# EAGLE design GPS (EAGLE 7.3.0)
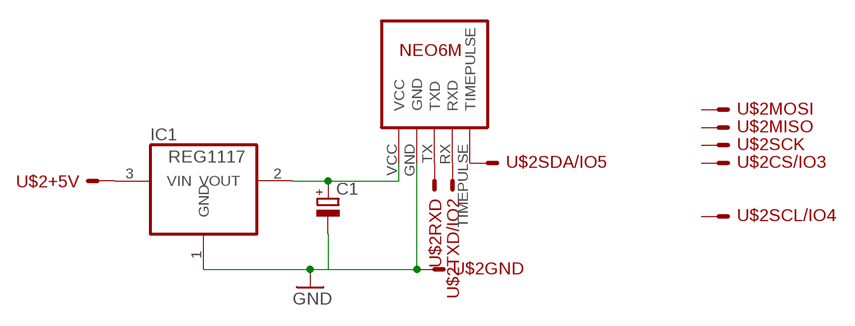
[diagram p0: schematic, sheet 1]

## Parts
C1  CPOL-EUB45181A  [B45181A]
IC1  REG1117  [SOT223]
U$1  NEO6M  [NEO6M]
U$2  LIMERO_BUS  [SPI_BUS]

## Nets
GND: C1.- IC1.1(GND) U$1.GND U$2.GND
N$1: C1.+ IC1.2(VOUT) U$1.VCC
N$3: U$1.TX(TXD) U$2.RXD
N$4: U$1.RX(RXD) U$2.TXD
N$5: U$1.TIMEPULSE U$2.SDA
N$6: IC1.3(VIN) U$2.+5V
Unconnected: U$2.CS U$2.MISO U$2.MOSI U$2.SCK U$2.SCL

## Library data of the parts
C1 = rcl:CPOL-EU: POLARIZED CAPACITOR, European symbol
IC1 = burr-brown:REG1117: 800mA and 1A Low Dropout (LDO) Positive Regulator 1.8V, 2.5V, 2.85V, 3.3V, 5V, and Adj; MPN: REG1117; OC_FARNELL: 1097566; OC_NEWARK: 14P6981
U$1 = lieven:NEO6M
U$2 = lieven:LIMERO_BUS

## Board
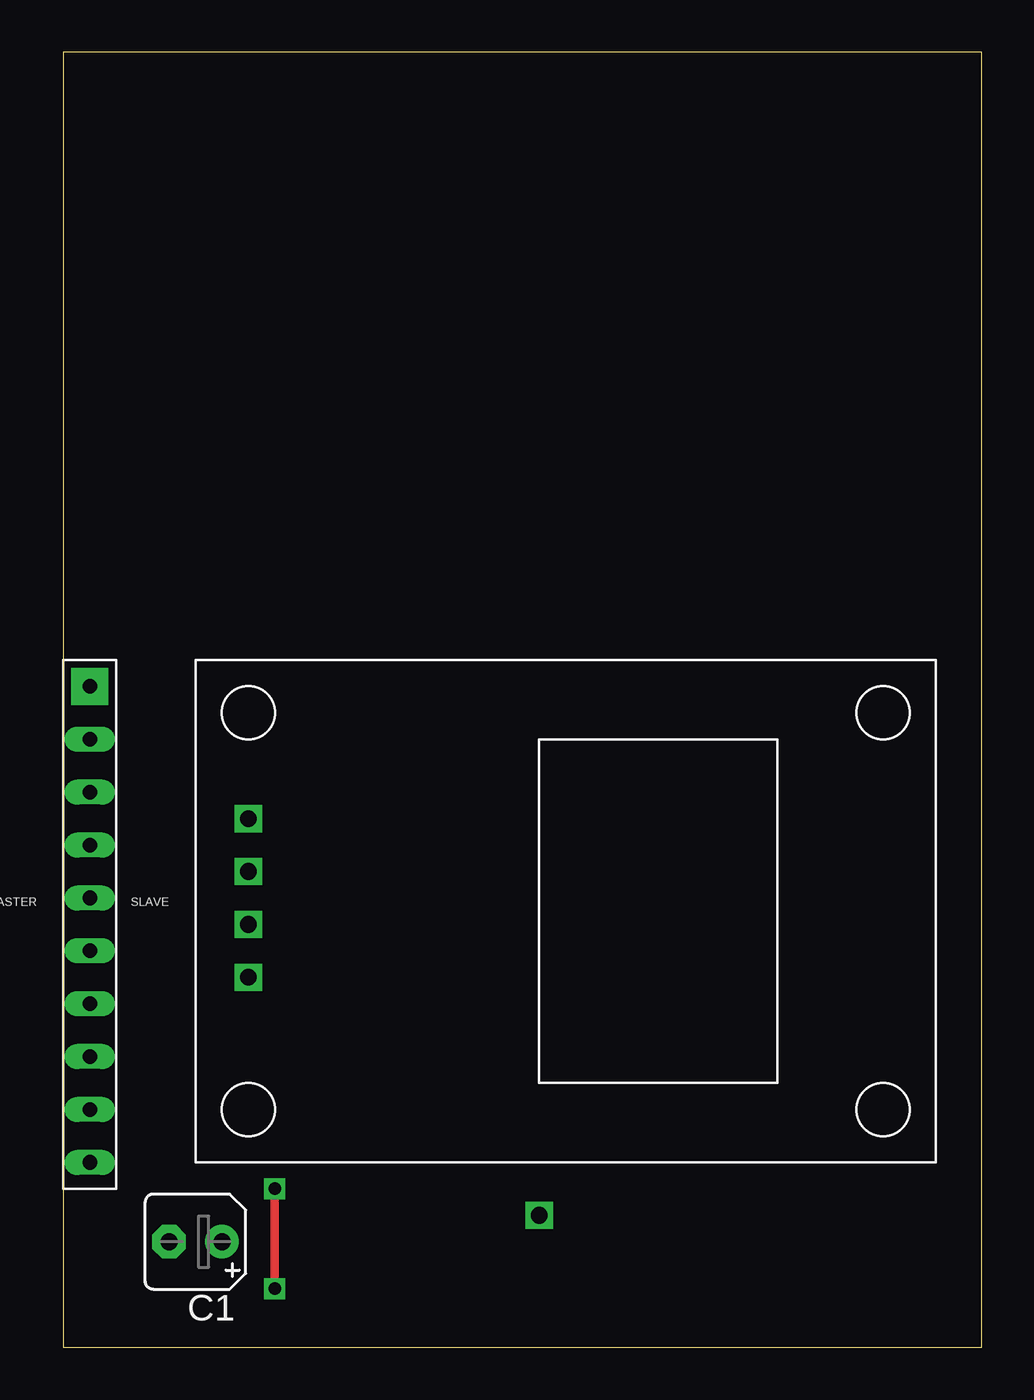
[diagram p1: board, top side]
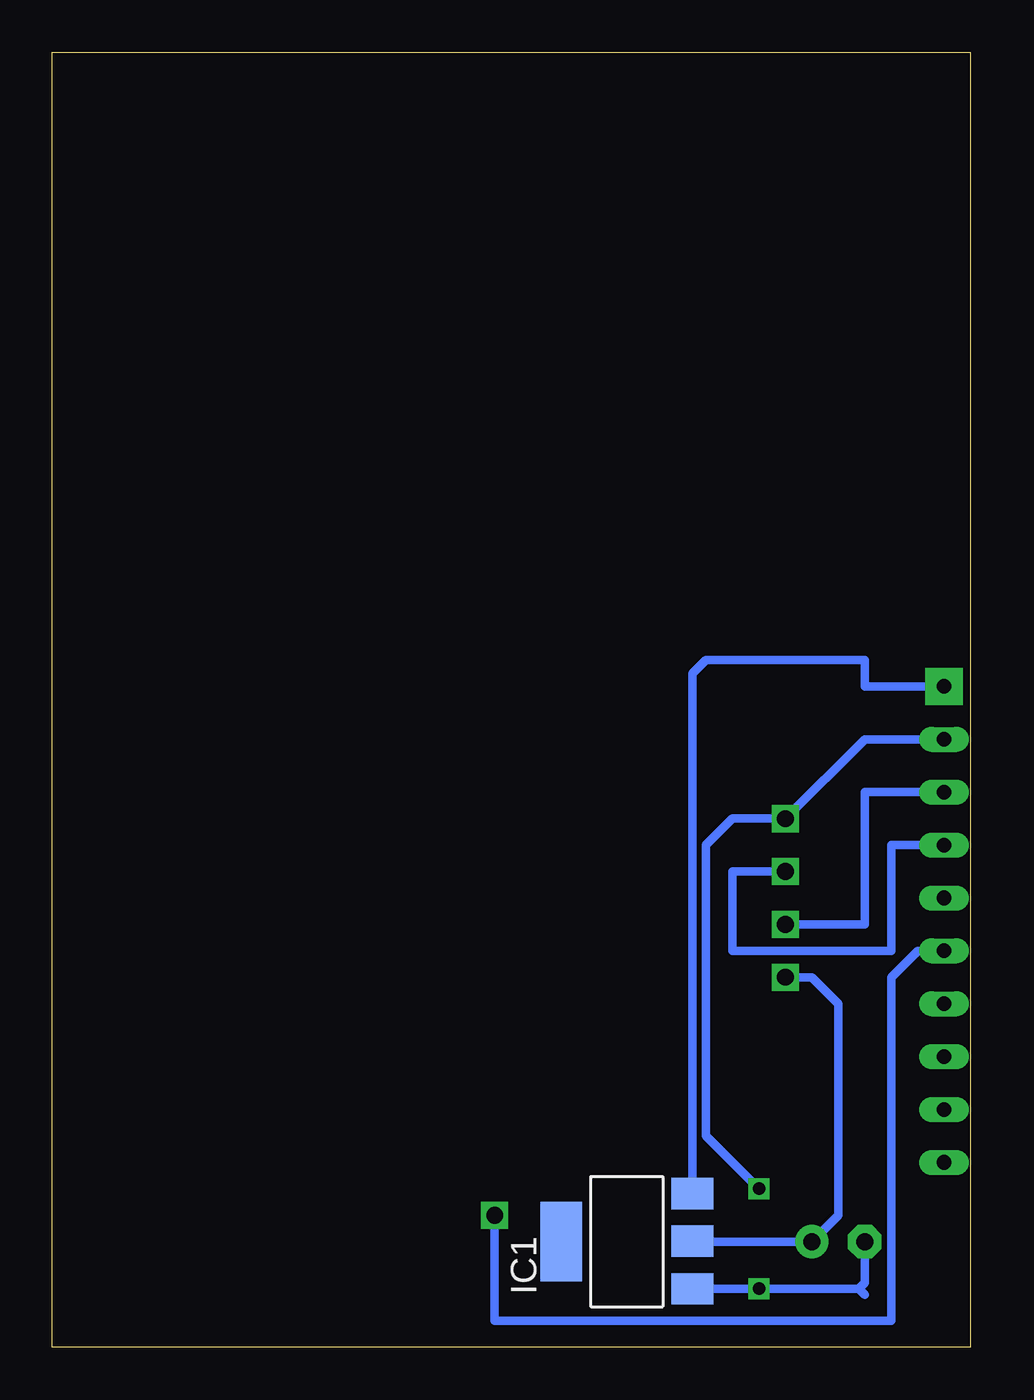
[diagram p2: board, bottom side, seen from below]

Size 44.12 x 62.22 mm. Coordinates in mm from the lower left corner, seen from the top.
Outline: 0,0 44.12,0 44.12,62.22 0,62.22 0,0
Copper layers (1*16): Top 0.035mm / dielectric 1.5mm / Bottom 0.035mm
Design rules "default": minimum track width 10mil, minimum drill 24mil, track to track 8mil, track to pad 8mil, pad to pad 8mil, via to via 8mil, smd to smd 8mil, copper to edge 40mil, drill to drill 8mil, minimum pad ring 10mil, minimum via ring 8mil, stop-mask expansion 4mil, vias tented up to drill 0mil, thermal gap 10mil

### Footprints (pad centres in the part's own frame; a part is rotated, then mirrored left to right if it is on the bottom)
B45181A = drill 0.813 pad 1.6: + -1.27,0 | drill 0.813 pad 1.6 octagon: - 1.27,0
SOT223 = smd 1.499 x 2.007: 1 -2.261,-3.15; 2 0.025,-3.15; 3 2.311,-3.15 | smd 3.81 x 2.007: 4 0,3.15
NEO6M = drill 0.8 square: GND 0,0; RX 5.08,0; TIMEPULSE 19.05,13.97; TX 2.54,0; VCC 7.62,0
SPI_BUS = drill 0.7 pad 1.778 square: +5V 0,0 | drill 0.7 long: CS 0,22.86; GND 0,2.54; MISO 0,15.24; MOSI 0,17.78; RXD 0,7.62; SCK 0,20.32; SCL 0,10.16; SDA 0,12.7; TXD 0,5.08

### Placement (x,y rotation side)
C1  6.35,5.08 180 top
IC1  16.51,5.08 90 bottom
U$1  8.89,25.4 270 top
U$2  1.27,31.75 180 top

### Tracks (layer width: path | path; a pad name or v marks a point on that pad's centre or on a via)
GND  (via drill 0.6)
  Top 0.406: v10.16,7.62 v10.16,2.82
  Bottom 0.406: U$2.GND 5.08,29.21 U$1.GND 11.43,25.4 12.7,24.13 12.7,10.16 v10.16,7.62 | IC1.1 v10.16,2.82 5.36,2.82 | 5.36,2.82 5.08,2.54 | C1.- 5.08,3.1 5.36,2.82
N$1
  Bottom 0.406: U$1.VCC 7.62,17.78 6.35,16.51 6.35,6.35 C1.+ 13.34,5.08 IC1.2
N$3
  Bottom 0.406: U$2.RXD 3.81,24.13 3.81,19.05 11.43,19.05 11.43,22.86 U$1.TX
N$4
  Bottom 0.406: U$2.TXD 5.08,26.67 5.08,20.32 U$1.RX
N$5
  Bottom 0.406: U$2.SDA 2.54,19.05 3.81,17.78 3.81,1.27 22.86,1.27 U$1.TIMEPULSE
N$6
  Bottom 0.406: IC1.3 13.36,32.36 12.7,33.02 5.08,33.02 5.08,31.75 U$2.+5V